# Altium project PDU PCB.PrjPcb
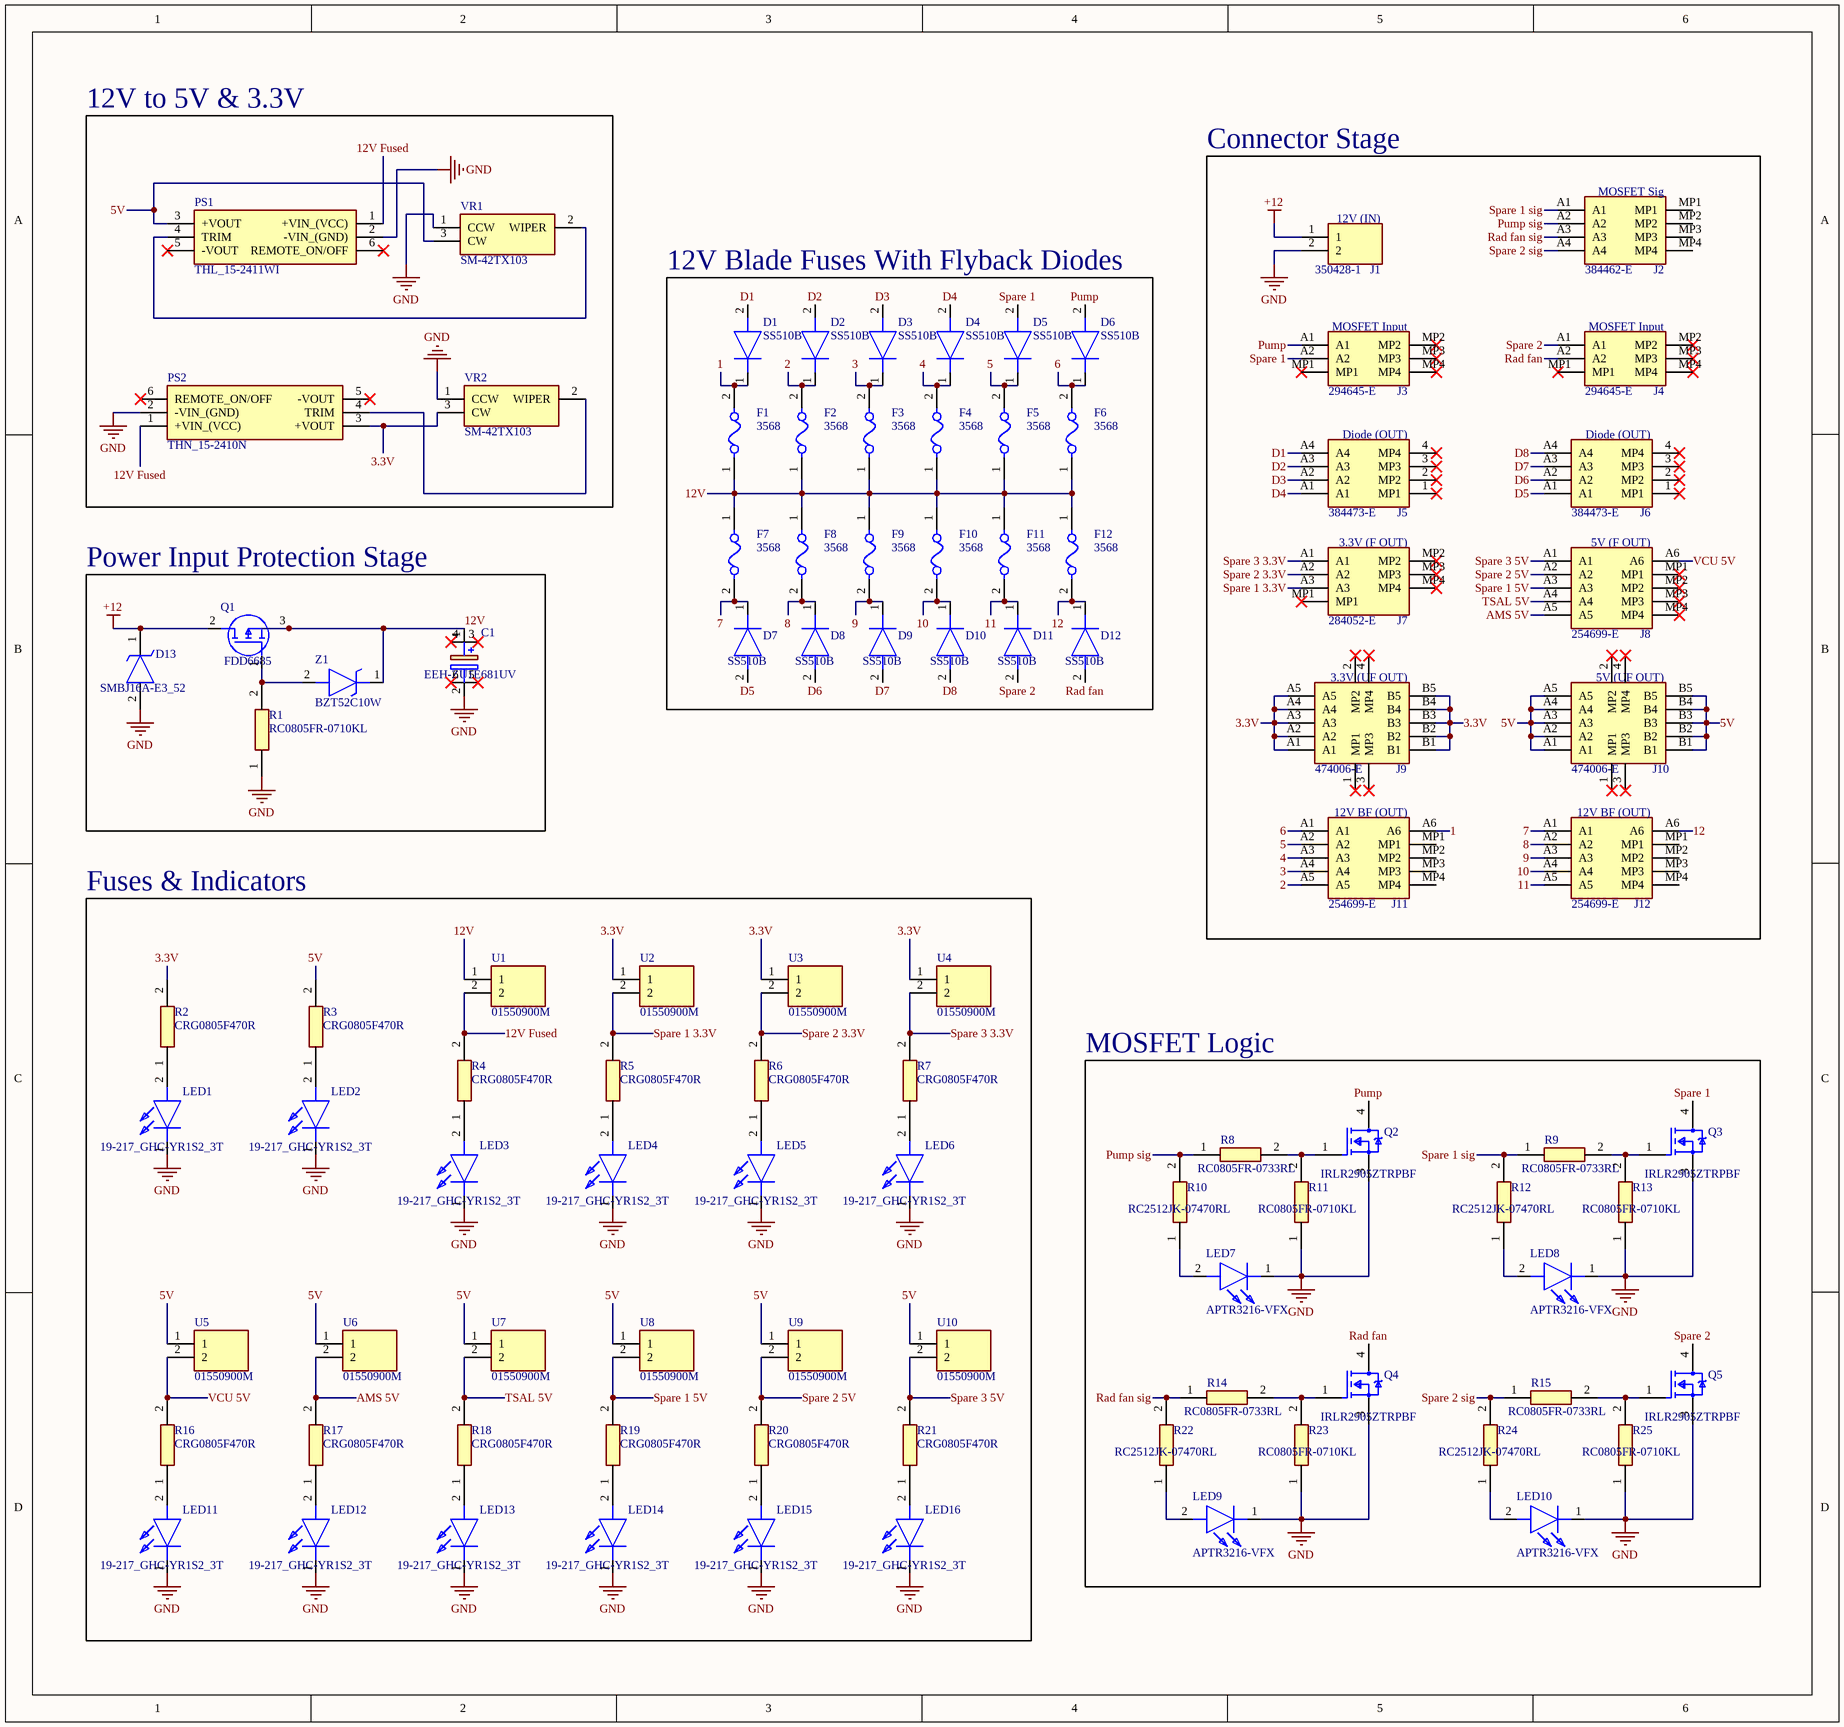
[diagram p0: PDU_Sch.SchDoc]
1 sheet, 99 parts. Net scope: global (net labels, ports and power ports of the same name join across sheets).
Board file: PDU.PcbDoc

## Sheet PDU_Sch.SchDoc
size 345 x 322 mm; SheetNumber: 1; SheetTotal: 1

### Parts
C1  EEH-ZU1E681UV  [EEHZU1E681UV]
D1  SS510B  [DIOM5336X244N]
D2  SS510B  [DIOM5336X244N]
D3  SS510B  [DIOM5336X244N]
D4  SS510B  [DIOM5336X244N]
D5  SS510B  [DIOM5336X244N]
D6  SS510B  [DIOM5336X244N]
D7  SS510B  [DIOM5336X244N]
D8  SS510B  [DIOM5336X244N]
D9  SS510B  [DIOM5336X244N]
D10  SS510B  [DIOM5336X244N]
D11  SS510B  [DIOM5336X244N]
D12  SS510B  [DIOM5336X244N]
D13  SMBJ16A-E3_52  [DIOM5436X244N]
F1  3568  [FP-3568-MFG]
F2  3568  [FP-3568-MFG]
F3  3568  [FP-3568-MFG]
F4  3568  [FP-3568-MFG]
F5  3568  [FP-3568-MFG]
F6  3568  [FP-3568-MFG]
F7  3568  [FP-3568-MFG]
F8  3568  [FP-3568-MFG]
F9  3568  [FP-3568-MFG]
F10  3568  [FP-3568-MFG]
F11  3568  [FP-3568-MFG]
F12  3568  [FP-3568-MFG]
J1  350428-1  [SHDR2W166P0X635_1X2_1397X762X1397P]
J2  384462-E  [384462E]
J3  294645-E  [294645E]
J4  294645-E  [294645E]
J5  384473-E  [384473E]
J6  384473-E  [384473E]
J7  284052-E  [284052E]
J8  254699-E  [254699E]
J9  474006-E  [474006E]
J10  474006-E  [474006E]
J11  254699-E  [254699E]
J12  254699-E  [254699E]
LED1  19-217_GHC-YR1S2_3T  [LEDC1608X50N]
LED2  19-217_GHC-YR1S2_3T  [LEDC1608X50N]
LED3  19-217_GHC-YR1S2_3T  [LEDC1608X50N]
LED4  19-217_GHC-YR1S2_3T  [LEDC1608X50N]
LED5  19-217_GHC-YR1S2_3T  [LEDC1608X50N]
LED6  19-217_GHC-YR1S2_3T  [LEDC1608X50N]
LED7  APTR3216-VFX  [LEDC3216X125N]
LED8  APTR3216-VFX  [LEDC3216X125N]
LED9  APTR3216-VFX  [LEDC3216X125N]
LED10  APTR3216-VFX  [LEDC3216X125N]
LED11  19-217_GHC-YR1S2_3T  [LEDC1608X50N]
LED12  19-217_GHC-YR1S2_3T  [LEDC1608X50N]
LED13  19-217_GHC-YR1S2_3T  [LEDC1608X50N]
LED14  19-217_GHC-YR1S2_3T  [LEDC1608X50N]
LED15  19-217_GHC-YR1S2_3T  [LEDC1608X50N]
LED16  19-217_GHC-YR1S2_3T  [LEDC1608X50N]
PS1  THL_15-2411WI  [THL152411WI]
PS2  THN_15-2410N  [THN152410N]
Q1  FDD6685  [FQD1N80TM]
Q2  IRLR2905ZTRPBF  [FP-PG-TO252-3-MFG]
Q3  IRLR2905ZTRPBF  [FP-PG-TO252-3-MFG]
Q4  IRLR2905ZTRPBF  [FP-PG-TO252-3-MFG]
Q5  IRLR2905ZTRPBF  [FP-PG-TO252-3-MFG]
R1  RC0805FR-0710KL  [RESC2012X60N]
R2  CRG0805F470R  [RESC2012X65N]
R3  CRG0805F470R  [RESC2012X65N]
R4  CRG0805F470R  [RESC2012X65N]
R5  CRG0805F470R  [RESC2012X65N]
R6  CRG0805F470R  [RESC2012X65N]
R7  CRG0805F470R  [RESC2012X65N]
R8  RC0805FR-0733RL  [RESC2012X60N]
R9  RC0805FR-0733RL  [RESC2012X60N]
R10  RC2512JK-07470RL  [RESC6431X65N]
R11  RC0805FR-0710KL  [RESC2012X60N]
R12  RC2512JK-07470RL  [RESC6431X65N]
R13  RC0805FR-0710KL  [RESC2012X60N]
R14  RC0805FR-0733RL  [RESC2012X60N]
R15  RC0805FR-0733RL  [RESC2012X60N]
R16  CRG0805F470R  [RESC2012X65N]
R17  CRG0805F470R  [RESC2012X65N]
R18  CRG0805F470R  [RESC2012X65N]
R19  CRG0805F470R  [RESC2012X65N]
R20  CRG0805F470R  [RESC2012X65N]
R21  CRG0805F470R  [RESC2012X65N]
R22  RC2512JK-07470RL  [RESC6431X65N]
R23  RC0805FR-0710KL  [RESC2012X60N]
R24  RC2512JK-07470RL  [RESC6431X65N]
R25  RC0805FR-0710KL  [RESC2012X60N]
U1  01550900M  [01550900M]
U2  01550900M  [01550900M]
U3  01550900M  [01550900M]
U4  01550900M  [01550900M]
U5  01550900M  [01550900M]
U6  01550900M  [01550900M]
U7  01550900M  [01550900M]
U8  01550900M  [01550900M]
U9  01550900M  [01550900M]
U10  01550900M  [01550900M]
VR1  SM-42TX103  [SM42TX103]
VR2  SM-42TX103  [SM42TX103]
Z1  BZT52C10W  [BZT52C10W]

### Blocks framed on the sheet
12V to 5V & 3.3V: PS1 PS2 VR1 VR2
Connector Stage: J1-J12
12V Blade Fuses With Flyback Diodes: D1-D12 F1-F12
Power Input Protection Stage: C1 D13 Q1 R1 Z1
Fuses & Indicators: LED1-LED6 LED11-LED16 R2-R7 R16-R21 U1-U10
MOSFET Logic: LED7-LED10 Q2-Q5 R8-R15 R22-R25

### Nets
+12: D13.1(K) J1.1 Q1.2(D)
GND: C1.2(-_1) D13.2(A) J1.2 LED1.1(K) LED2.1(K) LED3.1(K) LED4.1(K) LED5.1(K) LED6.1(K) LED7.1(K) LED8.1(K) LED9.1(K) LED10.1(K) LED11.1(K) LED12.1(K) LED13.1(K) LED14.1(K) LED15.1(K) LED16.1(K) PS1.2(-VIN_(GND)) PS2.2(-VIN_(GND)) Q2.3(S) Q3.3(S) Q4.3(S) Q5.3(S) R1.1 R11.1 R13.1 R23.1 R25.1 VR1.1(CCW) VR2.1(CCW)
1: D1.1(K) F1.2 J11.A6
2: D2.1(K) F2.2 J11.A5
3: D3.1(K) F3.2 J11.A4
3.3V: J9.A1 J9.A2 J9.A3 J9.A4 J9.A5 J9.B1 J9.B2 J9.B3 J9.B4 J9.B5 PS2.3(+VOUT) R2.2 U2.1 U3.1 U4.1 VR2.3(CW)
4: D4.1(K) F4.2 J11.A3
5: D5.1(K) F5.2 J11.A2
5V: J10.A1 J10.A2 J10.A3 J10.A4 J10.A5 J10.B1 J10.B2 J10.B3 J10.B4 J10.B5 PS1.3(+VOUT) R3.2 U5.1 U6.1 U7.1 U8.1 U9.1 U10.1 VR1.3(CW)
6: D6.1(K) F6.2 J11.A1
7: D7.1(K) F7.2 J12.A1
8: D8.1(K) F8.2 J12.A2
9: D9.1(K) F9.2 J12.A3
10: D10.1(K) F10.2 J12.A4
11: D11.1(K) F11.2 J12.A5
12: D12.1(K) F12.2 J12.A6
12V: C1.1(+_1) F1.1 F2.1 F3.1 F4.1 F5.1 F6.1 F7.1 F8.1 F9.1 F10.1 F11.1 F12.1 Q1.3(S) U1.1 Z1.1(K)
12V Fused: PS1.1(+VIN_(VCC)) PS2.1(+VIN_(VCC)) R4.2 U1.2
AMS 5V: J8.A5 R17.2 U6.2
D1: D1.2(A) J5.A4
D2: D2.2(A) J5.A3
D3: D3.2(A) J5.A2
D4: D4.2(A) J5.A1
D5: D7.2(A) J6.A1
D6: D8.2(A) J6.A2
D7: D9.2(A) J6.A3
D8: D10.2(A) J6.A4
Pump: D6.2(A) J3.A1 Q2.4(D)
Pump sig: J2.A2 R8.1 R10.2
Rad fan: D12.2(A) J4.A2 Q4.4(D)
Rad fan sig: J2.A3 R14.1 R22.2
Spare 1: D5.2(A) J3.A2 Q3.4(D)
Spare 1 3.3V: J7.A3 R5.2 U2.2
Spare 1 5V: J8.A3 R19.2 U8.2
Spare 1 sig: J2.A1 R9.1 R12.2
Spare 2: D11.2(A) J4.A1 Q5.4(D)
Spare 2 3.3V: J7.A2 R6.2 U3.2
Spare 2 5V: J8.A2 R20.2 U9.2
Spare 2 sig: J2.A4 R15.1 R24.2
Spare 3 3.3V: J7.A1 R7.2 U4.2
Spare 3 5V: J8.A1 R21.2 U10.2
TSAL 5V: J8.A4 R18.2 U7.2
VCU 5V: J8.A6 R16.2 U5.2
NetLED1_2: LED1.2(A) R2.1
NetLED2_2: LED2.2(A) R3.1
NetLED3_2: LED3.2(A) R4.1
NetLED4_2: LED4.2(A) R5.1
NetLED5_2: LED5.2(A) R6.1
NetLED6_2: LED6.2(A) R7.1
NetLED7_2: LED7.2(A) R10.1
NetLED8_2: LED8.2(A) R12.1
NetLED9_2: LED9.2(A) R22.1
NetLED10_2: LED10.2(A) R24.1
NetLED11_2: LED11.2(A) R16.1
NetLED12_2: LED12.2(A) R17.1
NetLED13_2: LED13.2(A) R18.1
NetLED14_2: LED14.2(A) R19.1
NetLED15_2: LED15.2(A) R20.1
NetLED16_2: LED16.2(A) R21.1
NetPS1_4: PS1.4(TRIM) VR1.2(WIPER)
NetPS2_4: PS2.4(TRIM) VR2.2(WIPER)
NetQ1_1: Q1.1(G) R1.2 Z1.2(A)
NetQ2_1: Q2.1(G) R8.2 R11.2
NetQ3_1: Q3.1(G) R9.2 R13.2
NetQ4_1: Q4.1(G) R14.2 R23.2
NetQ5_1: Q5.1(G) R15.2 R25.2

Not connected (* = marked no-connect by the designer): C1 3(+_2)* 4(+_3)* 5(-_2)* 6(-_3)*; J2 MP1 MP2 MP3 MP4; J3 MP1* MP2* MP3* MP4*; J4 MP1* MP2* MP3* MP4*; J5 1(MP1)* 2(MP2)* 3(MP3)* 4(MP4)*; J6 1(MP1)* 2(MP2)* 3(MP3)* 4(MP4)*; J7 MP1* MP2* MP3* MP4*; J8 MP1* MP2* MP3* MP4*; J9 1(MP1)* 2(MP2)* 3(MP3)* 4(MP4)*; J10 1(MP1)* 2(MP2)* 3(MP3)* 4(MP4)*; J11 MP1 MP2 MP3 MP4; J12 MP1 MP2 MP3 MP4; PS1 5(-VOUT)* 6(REMOTE_ON/OFF)*; PS2 5(-VOUT)* 6(REMOTE_ON/OFF)*

### Notes on the sheet
- (near J2) MOSFET Sig
- (near J1) 12V (IN)
- (near J3) MOSFET Input
- (near J4) MOSFET Input
- (near J5) Diode (OUT)
- (near J6) Diode (OUT)
- (near J7) 3.3V (F OUT)
- (near J8) 5V (F OUT)
- (near J9) 3.3V (UF OUT)
- (near J10) 5V (UF OUT)
- (near J11) 12V BF (OUT)
- (near J12) 12V BF (OUT)

### Library data of the parts
C1 = EEH-ZU1E681UV: Capacitor Polarised (6-Pin Vibration Proof); Manufacturer_Name: Panasonic; Datasheet Link: https://industrial.panasonic.com/cdbs/www-data/pdf/RDD0000/ast-ind-280898.pdf; Height: 12.8mm; Manufacturer_Part_Number: EEH-ZU1E681UV; Mouser Part Number: 667-EEH-ZU1E681UV; Mouser Price/Stock: https://www.mouser.co.uk/ProductDetail/Panasonic/EEH-ZU1E681UV?qs=HoCaDK9Nz5e6Q1bgl9oS6A%3D%3D
D1-D12 = SS510B: Diode; Manufacturer_Name: HY Electronic; Height: 2.44mm; Manufacturer_Part_Number: SS510B
D13 = SMBJ16A-E3_52: TVS Diode (Uni-directional); Manufacturer_Name: Vishay; Manufacturer_Part_Number: SMBJ16A-E3/52; Datasheet Link: http://www.vishay.com/docs/88392/smbj.pdf; Height: 2.44mm; Mouser Part Number: 625-SMBJ16A-E3; Mouser Price/Stock: https://www.mouser.co.uk/ProductDetail/Vishay-General-Semiconductor/SMBJ16A-E3-52?qs=3qLEwsAJF5T7oi0PUWfV9A%3D%3D; Arrow Part Number: SMBJ16A-E3/52; Arrow Price/Stock: https://www.arrow.com/en/products/smbj16a-e352/vishay?utm_currency=USD&region=nac
F1-F12 = CMP-2000-05464-2: NexarPartId: 8116161; Approvals: UL; Body Material: Nylon; Illumination Type: Illuminated; Voltage Rating (AC): 500V; Current Rating: 20A; Number of Poles: 1; Color: Black; Material: Brass, Nylon, Tin; Depth: 6.73mm; Max Operating Temperature: 145°C; Length: 16mm; Mount: PCB, Vertical; REACH SVHC: No SVHC; Lead Free: Lead Free; Min Operating Temperature: -50°C; Flammability Rating: UL94 V-0; RoHS: Compliant; Orientation: Vertical; Fuse Current: 20A; Termination: PC Pin; Number of Circuits: 1; Contact Plating: Tin; Voltage: 500V; Contact Material: Brass
J1 = 350428-1: Connector; Manufacturer_Name: TE Connectivity; Datasheet Link: https://www.te.com/commerce/DocumentDelivery/DDEController?Action=srchrtrv&DocNm=82181_SOFTSHELL_STANDARD_DENSITY&DocType=Catalog%20Section&DocLang=English&PartCntxt=350428-1&DocFormat=pdf; Height: 13.97mm; Manufacturer_Part_Number: 350428-1; Mouser Part Number: 571-3504281; Mouser Price/Stock: https://www.mouser.co.uk/ProductDetail/TE-Connectivity-AMP/350428-1?qs=wtYpWE7xRjnaxlxVUMYv0Q%3D%3D; Arrow Part Number: 350428-1; Arrow Price/Stock: https://www.arrow.com/en/products/350428-1/te-connectivity?utm_currency=USD&region=europe
J2 = 384462-E: Connector; Manufacturer_Name: TE Connectivity; Datasheet Link: https://www.te.com/usa-en/product-384462-E.html; Height: 9.9mm; Manufacturer_Part_Number: 384462-E; Mouser Part Number: 305-384462; Mouser Price/Stock: https://www.mouser.co.uk/ProductDetail/TE-Connectivity-ERNI/384462-E?qs=t7xnP681wgX9Dy4LjYOfWQ%3D%3D; Arrow Part Number: 384462-E; Arrow Price/Stock: https://www.arrow.com/en/products/384462-e/te-connectivity?utm_currency=USD&region=nac
J3 J4 = 294645-E: Connector; Manufacturer_Name: TE Connectivity; Datasheet Link: https://www.te.com/en/product-294645-E.html; Manufacturer_Part_Number: 294645-E; Mouser Part Number: 305-294645; Mouser Price/Stock: https://www.mouser.co.uk/ProductDetail/TE-Connectivity-ERNI/294645-E?qs=t7xnP681wgVnmJsGnqo%2Fag%3D%3D; Arrow Part Number: 294645-E; Arrow Price/Stock: https://www.arrow.com/en/products/294645-e/te-connectivity?utm_currency=USD&region=nac
J5 J6 = 384473-E: Connector; Manufacturer_Name: TE Connectivity; Datasheet Link: https://www.te.com/en/product-384473-E.datasheet.pdf; Height: 5.05mm; Manufacturer_Part_Number: 384473-E
J7 = 284052-E: Connector; Manufacturer_Name: TE Connectivity; Datasheet Link: https://www.te.com/commerce/DocumentDelivery/DDEController?Action=showdoc&DocId=Customer+Drawing%7F224919-E%7FE%7Fpdf%7FEnglish%7FENG_CD_224919-E_E.pdf%7F284052-E; Height: 5.05mm; Manufacturer_Part_Number: 284052-E; Mouser Part Number: 305-284052; Mouser Price/Stock: https://www.mouser.co.uk/ProductDetail/TE-Connectivity-ERNI/284052-E?qs=t7xnP681wgU7xBo%252Bl2asHw%3D%3D; Arrow Part Number: 284052-E; Arrow Price/Stock: https://www.arrow.com/en/products/284052-e/te-connectivity?utm_currency=USD&region=nac
J8 J11 J12 = 254699-E: Connector; Manufacturer_Name: TE Connectivity; Datasheet Link: https://www.te.com/commerce/DocumentDelivery/DDEController?Action=showdoc&DocId=Customer+Drawing%7F224913-E-C%7FE1%7Fpdf%7FGerman%7FGER_CD_224913-E-C_E1.pdf%7F254699-E; Height: 5.05mm; Manufacturer_Part_Number: 254699-E; Mouser Part Number: 305-254699; Mouser Price/Stock: https://www.mouser.co.uk/ProductDetail/TE-Connectivity-ERNI/254699-E?qs=t7xnP681wgU5kHrQQ3QprA%3D%3D; Arrow Part Number: 254699-E; Arrow Price/Stock: null?region=nac
J9 J10 = 474006-E: Connector; Manufacturer_Name: TE Connectivity; Datasheet Link: https://www.te.com/en/product-474006-E.html; Height: 9.4mm; Manufacturer_Part_Number: 474006-E; Mouser Part Number: 305-474006; Mouser Price/Stock: https://www.mouser.co.uk/ProductDetail/TE-Connectivity-ERNI/474006-E?qs=t7xnP681wgWXPbqtCfsedQ%3D%3D; Arrow Part Number: 474006-E; Arrow Price/Stock: https://www.arrow.com/en/products/474006-e/te-connectivity.html?utm_currency=USD&region=nac
LED1-LED6 LED11-LED16 = 19-217_GHC-YR1S2_3T: LED; Manufacturer_Name: Everlight; Manufacturer_Part_Number: 19-217/GHC-YR1S2/3T; Datasheet Link: https://www.mouser.co.uk/datasheet/2/143/19-217-GHC-YR1S2-3T-1663276.pdf; Height: 0.5mm; Mouser Part Number: 638-19217GHCYR1S23T; Mouser Price/Stock: https://www.mouser.co.uk/ProductDetail/Everlight/19-217-GHC-YR1S2-3T?qs=8cKuZ6Ok2lZjmFTUzVFjDg%3D%3D; Arrow Part Number: 19-217/GHC-YR1S2/3T; Arrow Price/Stock: https://www.arrow.com/en/products/19-217ghc-yr1s23t/everlight-electronics
LED7-LED10 = APTR3216-VFX: LED; Manufacturer_Name: Kingbright; Datasheet Link: https://componentsearchengine.com/Datasheets/1/APTR3216-VFX.pdf; Height: 1.25mm; Manufacturer_Part_Number: APTR3216-VFX; Mouser Part Number: 604-APTR3216-VFX; Mouser Price/Stock: https://www.mouser.co.uk/ProductDetail/Kingbright/APTR3216-VFX?qs=PzGy0jfpSMt1rhGZsZb%2Fqw%3D%3D
PS1 = THL_15-2411WI: Power Supply; Manufacturer_Name: Traco Power; Manufacturer_Part_Number: THL 15-2411WI; Datasheet Link: https://tracopower.com/thl15wi-datasheet/; Mouser Part Number: 495-THL15-2411WI; Mouser Price/Stock: https://www.mouser.co.uk/ProductDetail/TRACO-Power/THL-15-2411WI?qs=vLWxofP3U2zTxW0y6%2FAPOg%3D%3D
PS2 = THN_15-2410N: Power Supply; Manufacturer_Name: Traco Power; Manufacturer_Part_Number: THN 15-2410N; Datasheet Link: https://tracopower.com/thn15n-datasheet/; Height: 10.4mm; Mouser Part Number: 495-THN15-2410N; Mouser Price/Stock: https://www.mouser.co.uk/ProductDetail/TRACO-Power/THN-15-2410N?qs=lc2O%252BfHJPVZmX9t5SPwnew%3D%3D
Q1 = FDD6685: MOSFET (P-Channel); Manufacturer_Name: onsemi; Datasheet Link: https://www.onsemi.com/pub/Collateral/FDD6685-D.PDF; Height: 2.39mm; Manufacturer_Part_Number: FDD6685; Mouser Part Number: 512-FDD6685; Mouser Price/Stock: https://www.mouser.co.uk/ProductDetail/onsemi-Fairchild/FDD6685?qs=lOBONITtCKxDT3dikVb2%252Bg%3D%3D; Arrow Part Number: FDD6685; Arrow Price/Stock: https://www.arrow.com/en/products/fdd6685/on-semiconductor?region=nac
Q2-Q5 = CMP-32901-000715-1: MOSFET N-CH 55V 42A DPAK; Max Power Dissipation: 110W; Input Capacitance: 1.57nF; Gate to Source Voltage (Vgs): 16V; Drain to Source Resistance: 13.5mR; Turn-On Delay Time: 14ns; Turn-Off Delay Time: 24ns; Max Dual Supply Voltage: 55V; RoHS Compliant: Yes; Number of Pins: 3; Continuous Drain Current (ID): 42A; Power Dissipation: 110W; Height: 0.094inch; Drain to Source Voltage (Vdss): 55V; Case/Package: TO-252-3; Mount: Surface Mount; Lead Free: Contains Lead; Packaging: Cut Tape; Length: 0.264inch; Max Operating Temperature: 175°C; Rds On Max: 13.5mR; Min Operating Temperature: -55°C; Series: HEXFET®; Halogen Free: Halogen Free; Width: 0.245inch
R1 R11 R13 R23 R25 = RC0805FR-0710KL: Resistor; Manufacturer_Name: Yageo Group; Datasheet Link: https://www.yageo.com/upload/media/product/productsearch/datasheet/rchip/PYu-RC_Group_51_RoHS_L_11.pdf; Height: 0.6mm; Manufacturer_Part_Number: RC0805FR-0710KL; Mouser Part Number: 603-RC0805FR-0710KL; Mouser Price/Stock: https://www.mouser.co.uk/ProductDetail/YAGEO/RC0805FR-0710KL?qs=7bY8808IzHq6vrU3BeiiYw%3D%3D; Arrow Part Number: RC0805FR-0710KL; Arrow Price/Stock: https://www.arrow.com/en/products/rc0805fr-0710kl/yageo.html?utm_currency=USD&region=europe
R2-R7 R16-R21 = CRG0805F470R: Resistor; Manufacturer_Name: TE Connectivity; Datasheet Link: https://www.te.com/commerce/DocumentDelivery/DDEController?Action=srchrtrv&DocNm=1773204&DocType=Data%20Sheet&DocLang=English&PartCntxt=1623232-1&DocFormat=pdf; Height: 0.65mm; Manufacturer_Part_Number: CRG0805F470R; Mouser Part Number: 279-CRG0805F470R; Mouser Price/Stock: https://www.mouser.co.uk/ProductDetail/TE-Connectivity-Holsworthy/CRG0805F470R?qs=VHcS2MTj4gY7OTd8XzqSww%3D%3D; Arrow Part Number: CRG0805F470R; Arrow Price/Stock: https://www.arrow.com/en/products/crg0805f470r/te-connectivity?region=nac
R8 R9 R14 R15 = RC0805FR-0733RL: Resistor; Manufacturer_Name: Yageo Group; Datasheet Link: https://www.yageo.com/upload/media/product/productsearch/datasheet/rchip/PYu-RC_Group_51_RoHS_L_12.pdf; Height: 0.6mm; Manufacturer_Part_Number: RC0805FR-0733RL; Mouser Part Number: 603-RC0805FR-0733RL; Mouser Price/Stock: https://www.mouser.co.uk/ProductDetail/YAGEO/RC0805FR-0733RL?qs=g6xwsc4j%252B%2Fq7KbipsIEOLQ%3D%3D; Arrow Part Number: RC0805FR-0733RL; Arrow Price/Stock: https://www.arrow.com/en/products/rc0805fr-0733rl/yageo?region=nac
R10 R12 R22 R24 = RC2512JK-07470RL: Resistor; Manufacturer_Name: Yageo Group; Datasheet Link: https://componentsearchengine.com/Datasheets/2/RC2512JK-07470RL.pdf; Height: 0.65mm; Manufacturer_Part_Number: RC2512JK-07470RL; Mouser Part Number: 603-RC2512JK-07470RL; Mouser Price/Stock: https://www.mouser.com/Search/Refine.aspx?Keyword=603-RC2512JK-07470RL; Arrow Part Number: RC2512JK-07470RL; Arrow Price/Stock: https://www.arrow.com/en/products/rc2512jk-07470rl/yageo
U1-U10 = 01550900M: Undefined or Miscellaneous; Manufacturer_Name: LITTELFUSE; Datasheet Link: http://www.littelfuse.com/~/media/electronics/datasheets/fuses/littelfuse_fuse_154_154t_154l_154tl_datasheet.pdf.pdf; Height: 3.81mm; Manufacturer_Part_Number: 01550900M; Mouser Part Number: 576-01550900M; Mouser Price/Stock: https://www.mouser.co.uk/ProductDetail/Littelfuse/01550900M?qs=DDoybve0rC%252BTXq1hqi5X1g%3D%3D; Arrow Part Number: 01550900M; Arrow Price/Stock: https://www.arrow.com/en/products/01550900m/littelfuse.html?utm_currency=USD&region=europe
VR1 VR2 = SM-42TX103: Variable Resistor; Manufacturer_Name: Nidec Copal; Datasheet Link: https://www.nidec-copal-electronics.com/e/catalog/trimmer/sm-42&sm-43.pdf; Height: 5.3mm; Manufacturer_Part_Number: SM-42TX103; Mouser Part Number: 229-SM-42TX103; Mouser Price/Stock: https://www.mouser.co.uk/ProductDetail/Nidec-Components/SM-42TX103?qs=XeJtXLiO41SMjpR%2FkLkejw%3D%3D
Z1 = BZT52C10W: Zener Diode; Manufacturer_Name: Yageo Group; Datasheet Link: https://www.yageo.com/upload/media/product/products/datasheet/cpc/diode/zener/BZT52CXXW_1.pdf; Height: 1.15mm; Manufacturer_Part_Number: BZT52C10W; Arrow Part Number: BZT52C10W; Arrow Price/Stock: https://www.arrow.com/en/products/bzt52c10w/yageo.html?utm_currency=USD&region=europe